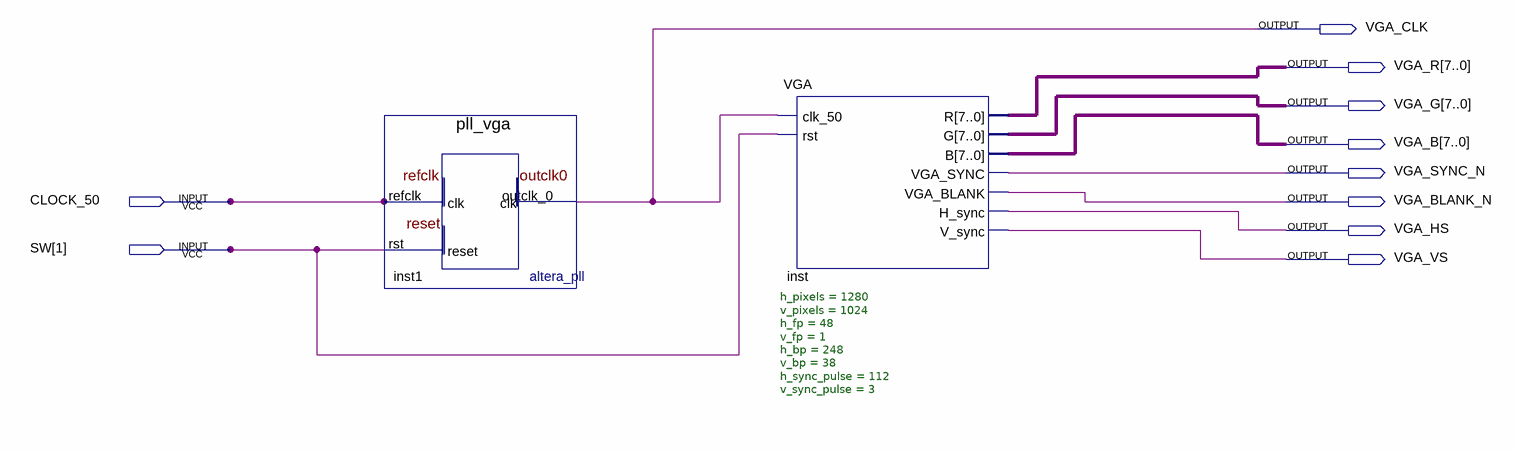
[diagram p0: schematic sheet]
// Quartus schematic vga_top.bdf as structural Verilog: 2 symbols, 10 pins
module vga_top (
  input  CLOCK_50,
  input  [1:1] SW,
  output VGA_CLK,
  output [7:0] VGA_R,
  output [7:0] VGA_G,
  output [7:0] VGA_B,
  output VGA_SYNC_N,
  output VGA_BLANK_N,
  output VGA_HS,
  output VGA_VS
);

  pll_vga inst1 (.refclk(CLOCK_50), .rst(SW[1]), .outclk_0(VGA_CLK));
  VGA #(.h_pixels(1280), .v_pixels(1024), .h_fp(48), .v_fp(1), .h_bp(248), .v_bp(38), .h_sync_pulse(112), .v_sync_pulse(3)) inst (
    .clk_50(VGA_CLK), .rst(SW[1]), .R(VGA_R), .G(VGA_G), .B(VGA_B), .VGA_SYNC(VGA_SYNC_N),
    .VGA_BLANK(VGA_BLANK_N), .H_sync(VGA_HS), .V_sync(VGA_VS));
endmodule
